# EAGLE design ADIS16209 Teensy rev2 (EAGLE 9.5.0)
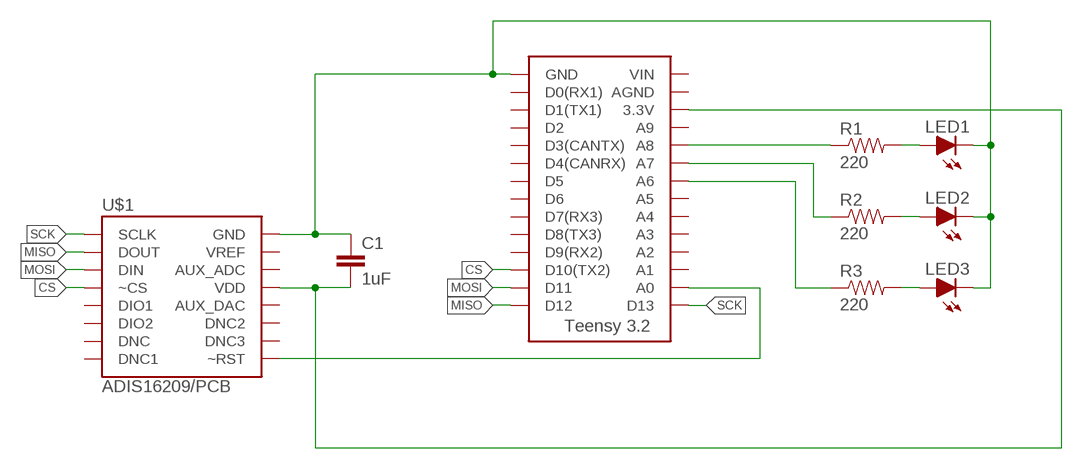
[diagram p0: schematic, sheet 1]

## Parts
C1  1uF  CAPKIT  [CAP-PTH-SMALL-KIT]
LED1  LED-5MM  [LED-5MM]
LED2  LED-5MM  [LED-5MM]
LED3  LED-5MM  [LED-5MM]
R1  220  RESISTORPTH-1/4W  [AXIAL-0.4]
R2  220  RESISTORPTH-1/4W  [AXIAL-0.4]
R3  220  RESISTORPTH-1/4W  [AXIAL-0.4]
U$1  ADIS16209/PCB  [ADIS16209/PCB]
U$2  TEENSY_3.2_SIMPLE  [TEENSY_3.2_SIMPLE]

## Nets
+3V3: C1.2 U$1.P$10(VDD) U$1.P$11(VDD) U$1.P$12(VDD) U$2.3.3V
CS: U$1.P$3(~CS) U$2.D10(TX2)
GND: C1.1 LED1.K(C) LED2.K(C) LED3.K(C) U$1.P$7(GND) U$1.P$8(GND) U$1.P$14(GND) U$1.P$17(GND) U$2.GND
MISO: U$1.P$4(DOUT) U$2.D12
MOSI: U$1.P$6(DIN) U$2.D11
N$1: LED1.A R1.P$2
N$2: U$1.P$1(~RST) U$2.A0
N$3: R1.P$1 U$2.A8
N$4: R2.P$1 U$2.A7
N$5: R3.P$1 U$2.A6
N$6: LED2.A R2.P$2
N$7: LED3.A R3.P$2
SCK: U$1.P$2(SCLK) U$2.D13
Unconnected: U$1.P$5(VREF) U$1.P$9(VREF) U$1.P$13(AUX_ADC) U$1.P$15(AUX_DAC) U$1.P$16(VREF) U$1.P$18(VREF) U$1.P$19(DNC3) U$1.P$20(DNC2) U$1.P$21(DNC1) U$1.P$22(DNC) U$1.P$23(DIO2) U$1.P$24(DIO1) U$2.A1 U$2.A2 U$2.A3 U$2.A4 U$2.A5 U$2.A9 U$2.AGND U$2.D0(RX1) U$2.D1(TX1) U$2.D2 U$2.D3(CANTX) U$2.D4(CANRX) U$2.D5 U$2.D6 U$2.D7(RX3) U$2.D8(TX3) U$2.D9(RX2) U$2.VIN

## Library data of the parts
C1 = HyTechDevices:CAP: Capacitor Standard 0603 ceramic capacitor, and 0.1" leaded capacitor.
LED1-LED3 = HyTechDevices:LED: Light Emitting Diode (LED) Source: Dangerous Prototypes Eagle Library <https://github.com/DangerousPrototypes/Eagle_Part_Library>
R1-R3 = HyTechDevices:RESISTOR: Resistor Basic schematic elements and footprints for 0603, 1206, and PTH resistors.
U$1 = HyTechDevices:ADIS16209: Analog Devices ADIS16209 High Accuracy, Dual-Axis Digital Inclinometer and Accelerometer
U$2 = HyTechDevices:TEENSY_3.2_SIMPLE: Simple version of the Teensy 3.2 board that only uses the 2 main rows of pins, not the inner pins or the pins opposite the usb port.

## Board
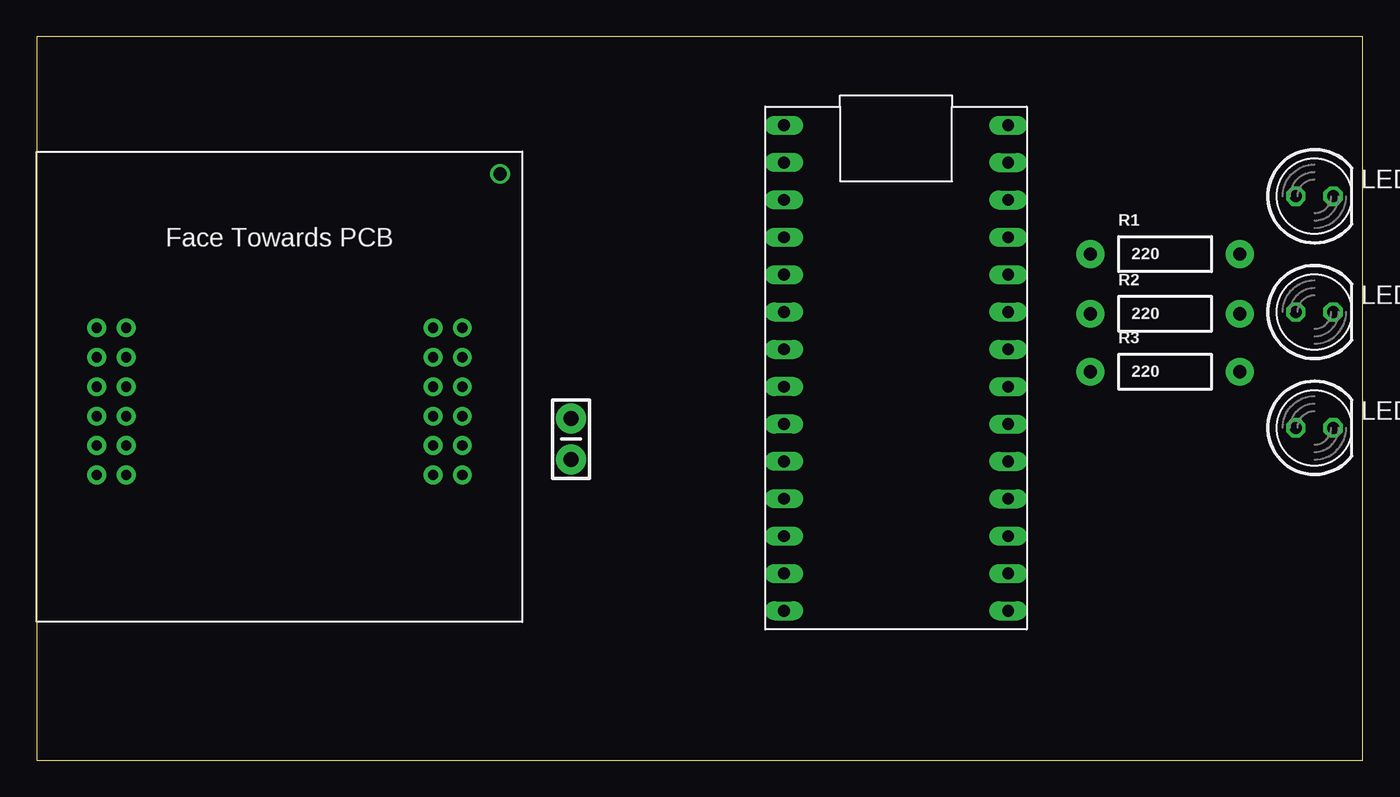
[diagram p1: board, top side]
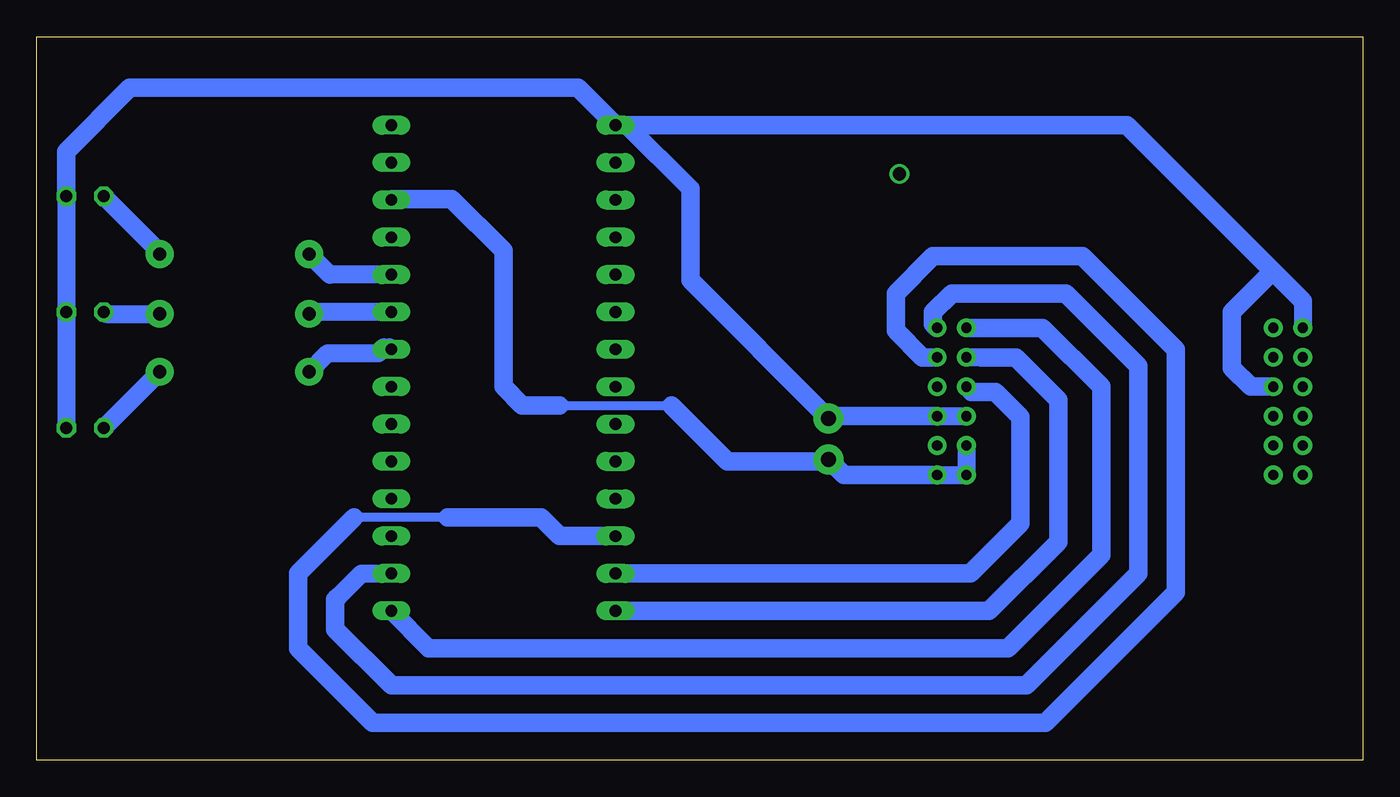
[diagram p2: board, bottom side, seen from below]

Size 90.15 x 49.2 mm. Coordinates in mm from the lower left corner, seen from the top.
Outline: 0,0 90.15,0 90.15,49.2 0,49.2 0,0
Copper layers 16: Bottom 0.035mm
Design rules "On Campus (1 Layer with Rubout)": minimum track width 10mil, minimum drill 0.8mm, track to track 10mil, track to pad 10mil, pad to pad 10mil, via to via 10mil, smd to smd 10mil, copper to edge 40mil, drill to drill 10mil, minimum pad ring 10mil, minimum via ring 8mil, stop-mask expansion 4mil, vias tented up to drill 0mil, thermal gap 10mil

### Footprints (pad centres in the part's own frame; a part is rotated, then mirrored left to right if it is on the bottom)
CAP-PTH-SMALL-KIT = drill 1.016 pad 2.032: 1 -1.397,0; 2 1.397,0
LED-5MM = drill 0.813 octagon: A -1.27,0; K 1.27,0
AXIAL-0.4 = drill 0.9 pad 1.88: P$1 -5.08,0; P$2 5.08,0
ADIS16209/PCB = drill 0.7 pad 1.27: P$1 12.43,4; P$2 10.43,4; P$3 12.43,2; P$4 10.43,2; P$5 12.43,0; P$6 10.43,0; P$7 12.43,-2; P$8 10.43,-2; P$9 12.43,-4; P$10 10.43,-4; P$11 12.43,-6; P$12 10.43,-6; P$13 -10.43,4; P$14 -12.43,4; P$15 -10.43,2; P$16 -12.43,2; P$17 -10.43,0; P$18 -12.43,0; P$19 -10.43,-2; P$20 -12.43,-2; P$21 -10.43,-4; P$22 -12.43,-4; P$23 -10.43,-6; P$24 -12.43,-6
TEENSY_3.2_SIMPLE = drill 0.8 long: 3.3V 16.51,29.21; A0 16.51,3.81; A1 16.51,6.35; A2 16.51,8.89; A3 16.51,11.43; A4 16.51,13.97; A5 16.51,16.51; A6 16.51,19.05; A7 16.51,21.59; A8 16.51,24.13; A9 16.51,26.67; AGND 16.51,31.75; D0(RX1) 1.27,31.75; D1(TX1) 1.27,29.21; D2 1.27,26.67; D3(CANTX) 1.27,24.13; D4(CANRX) 1.27,21.59; D5 1.27,19.05; D6 1.27,16.51; D7(RX3) 1.27,13.97; D8(TX3) 1.27,11.43; D9(RX2) 1.27,8.89; D10(TX2) 1.27,6.35; D11 1.27,3.81; D12 1.27,1.27; D13 16.51,1.27; GND 1.27,34.29; VIN 16.51,34.29

### Placement (x,y rotation side)
C1  36.32,21.84 270 top
LED1  86.87,38.35 0 top
LED2  86.87,30.48 0 top
LED3  86.87,22.61 0 top
R1  76.71,34.42 0 top
R2  76.71,30.35 0 top
R3  76.71,26.42 0 top
U$1  16.51,25.4 0 top
U$2  49.53,8.89 0 top

### Tracks (layer width: path | path; a pad name or v marks a point on that pad's centre or on a via)
+3V3
  Bottom 0.61: 54.61,24.13 46.99,24.13
  Bottom 1.219: U$1.P$10 U$1.P$12 U$1.P$11 30.21,19.4
  Bottom 1.27: U$1.P$11 35.27,19.4 C1.2 36.45,20.32 43.18,20.32 46.99,24.13 | 54.61,24.13 57.15,24.13 58.42,25.4 58.42,34.66 61.93,38.17 65.97,38.17 U$2.3.3V
CS
  Bottom 0.61: 62.23,16.51 68.58,16.51
  Bottom 1.27: U$2.D10(TX2) 54.61,15.24 55.88,16.51 62.23,16.51 | 68.58,16.51 72.39,12.7 72.39,7.62 67.31,2.54 21.59,2.54 12.7,11.43 12.7,27.94 19.05,34.29 29.21,34.29 31.75,31.75 31.75,29.21 29.94,27.4 U$1.P$3
GND
  Bottom 1.219: U$1.P$7 U$1.P$8 | U$2.GND 50.04,43.18 45.72,38.86 | LED1.K LED2.K LED3.K | 4.08,31.21 U$1.P$14
  Bottom 1.27: U$1.P$7 36.16,23.4 C1.1 45.72,32.64 45.72,38.86 | 6.12,33.25 16.05,43.18 U$2.GND 53.34,45.72 83.82,45.72 88.14,41.4 LED1.K | 6.12,33.25 4.08,31.21 | U$1.P$17 7.62,25.4 8.89,26.67 8.89,30.48 6.12,33.25
MISO
  Bottom 1.219: 25.94,27.4 U$1.P$4
  Bottom 1.27: 25.94,27.4 23.59,27.4 20.7,24.51 20.7,14.86 25.4,10.16 U$2.D12
MOSI
  Bottom 1.219: 50.04,12.7 U$2.D11
  Bottom 1.27: U$2.D11 26.67,12.7 23.27,16.1 23.27,23.33 24.99,25.05 26.59,25.05 U$1.P$6
N$1
  Bottom 1.219: LED1.A 81.79,34.54 R1.P$2
N$2
  Bottom 1.219: U$2.A0 68.07,12.7 69.58,11.19
  Bottom 1.27: 69.58,11.19 69.85,10.92 69.85,8.89 66.04,5.08 22.86,5.08 15.24,12.7 15.24,26.8 20.19,31.75 27.94,31.75 29.21,30.48 29.21,29.67 U$1.P$1
N$3
  Bottom 1.219: U$2.A8 70.23,33.02 R1.P$1
N$4
  Bottom 1.219: U$2.A7 71.5,30.48 R2.P$1
N$5
  Bottom 1.219: R3.P$1 70.36,27.69 66.93,27.69 66.55,28.07 66.17,28.07 U$2.A6
N$6
  Bottom 1.219: LED2.A 85.47,30.35 R2.P$2
N$7
  Bottom 1.219: LED3.A R3.P$2
N$8  (via drill 0.9)
  other vias: 31.5,39.88
SCK
  Bottom 1.219: 63.5,7.62 U$2.D13
  Bottom 1.27: U$1.P$2 21.78,29.4 17.78,25.4 17.78,13.97 24.13,7.62 63.5,7.62